# EAGLE schematic Connections (EAGLE 9.6.2)
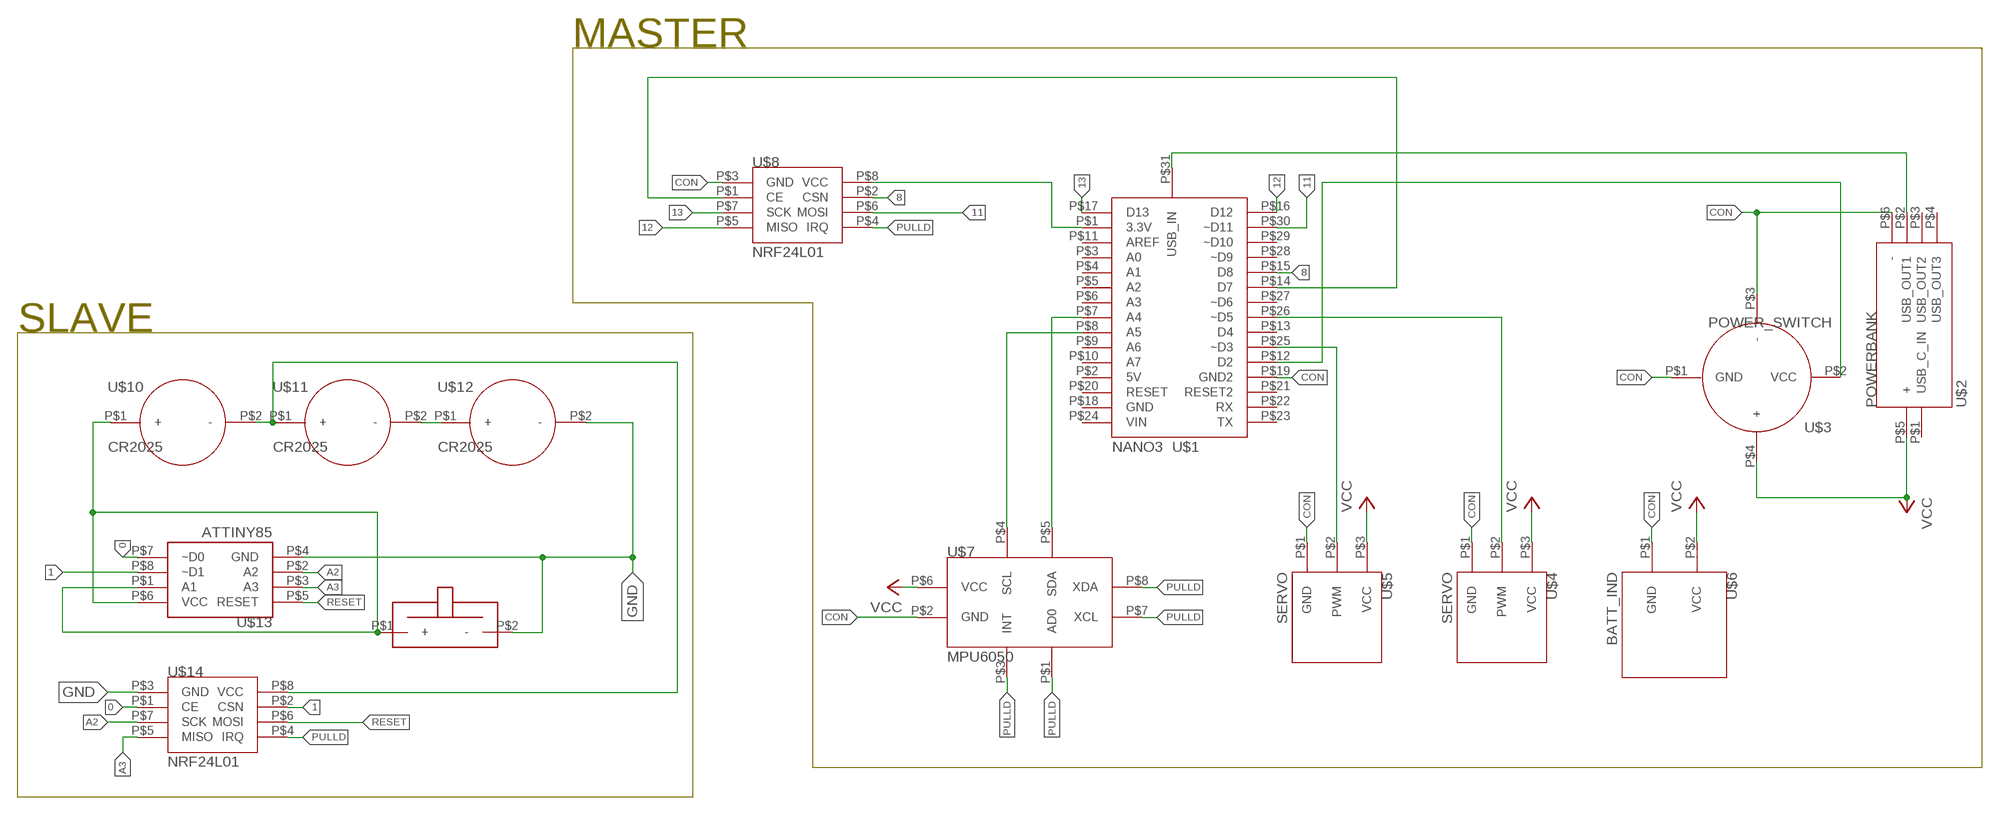
[diagram p0: schematic, sheet 1]

## Parts
U$1  NANO3  [NANO3]
U$2  POWERBANK  [POWERBANK]
U$3  POWER_SWITCH  [POWER_SWITCH]
U$4  SERVO  [SERVO]
U$5  SERVO  [SERVO]
U$6  BATT_IND  [BATT_IND]
U$7  MPU6050  [MPU6050]
U$8  NRF24L01  [NRF24L01]
U$9  SPST  [SPST]
U$10  CR2025  [CR2025]
U$11  CR2025  [CR2025]
U$12  CR2025  [CR2025]
U$13  ATTINY85  [ATTINY85]
U$14  NRF24L01  [NRF24L01]

## Nets
0: U$13.P$7(~D0)
1: U$13.P$8(~D1)
8: U$1.P$15(D8)
11: U$1.P$30(~D11)
12: U$8.P$5(MISO)
13: U$8.P$7(SCK)
A2: U$13.P$2(A2)
A3: U$13.P$3(A3)
CON: U$1.P$19(GND2)
GND: U$9.P$2(-) U$12.P$2(-) U$13.P$4(GND)
N$1: U$1.P$31(USB_IN) U$2.P$2(USB_OUT1)
N$2: U$1.P$25(~D3) U$5.P$2(PWM)
N$3: U$2.P$6(-) U$3.P$3(-)
N$4: U$3.P$1(GND)
N$5: U$1.P$12(D2) U$3.P$2(VCC)
N$6: U$5.P$1(GND)
N$7: U$1.P$26(~D5) U$4.P$2(PWM)
N$8: U$4.P$1(GND)
N$9: U$6.P$1(GND)
N$10: U$1.P$8(A5) U$7.P$4(SCL)
N$11: U$7.P$2(GND)
N$12: U$1.P$7(A4) U$7.P$5(SDA)
N$13: U$1.P$16(D12)
N$14: U$7.P$7(XCL)
N$15: U$7.P$1(AD0)
N$16: U$7.P$3(INT)
N$17: U$1.P$14(D7) U$8.P$1(CE)
N$18: U$1.P$17(D13)
N$19: U$8.P$3(GND)
N$20: U$1.P$1(3.3V) U$8.P$8(VCC)
N$21: U$8.P$2(CSN)
N$23: U$8.P$4(IRQ)
N$24: U$8.P$6(MOSI)
N$25: U$10.P$2(-) U$11.P$1(+) U$14.P$8(VCC)
N$26: U$11.P$2(-) U$12.P$1(+)
N$27: U$14.P$3(GND)
N$29: U$9.P$1(+) U$10.P$1(+) U$13.P$1(A1) U$13.P$6(VCC)
N$30: U$14.P$4(IRQ)
N$31: U$14.P$1(CE)
N$33: U$14.P$2(CSN)
N$34: U$14.P$6(MOSI)
N$35: U$14.P$7(SCK)
N$36: U$14.P$5(MISO)
PULLD: U$7.P$8(XDA)
RESET: U$13.P$5(RESET)
VCC: U$2.P$5(+) U$3.P$4(+) U$4.P$3(VCC) U$5.P$3(VCC) U$6.P$2(VCC) U$7.P$6(VCC)
Unconnected: U$1.P$2(5V) U$1.P$3(A0) U$1.P$4(A1) U$1.P$5(A2) U$1.P$6(A3) U$1.P$9(A6) U$1.P$10(A7) U$1.P$11(AREF) U$1.P$13(D4) U$1.P$18(GND) U$1.P$20(RESET) U$1.P$21(RESET2) U$1.P$22(RX) U$1.P$23(TX) U$1.P$24(VIN) U$1.P$27(~D6) U$1.P$28(~D9) U$1.P$29(~D10) U$2.P$1(USB_C_IN) U$2.P$3(USB_OUT2) U$2.P$4(USB_OUT3)

## Notes on the sheet
- MASTER
- SLAVE

## Library data of the parts
U$1 = arduino_nano3:NANO3
U$2 = powerbank:POWERBANK
U$3 = power_switch:POWER_SWITCH
U$4 U$5 = servo:SERVO
U$6 = battery_indicator:BATT_IND
U$7 = mpu6050:MPU6050
U$8 U$14 = nrf24l01:NRF24L01
U$9 = spst:SPST
U$10-U$12 = cr2025:CR2025
U$13 = attiny85:ATTINY85